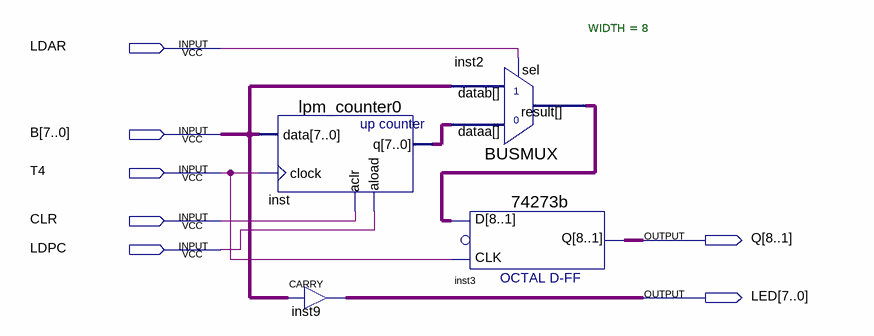
[diagram p0: schematic sheet]
// Quartus schematic Qinka-5.bdf as structural Verilog: 4 symbols, 7 pins
module \Qinka-5  (
  input  LDAR,
  input  [7:0] B,
  input  T4,
  input  CLR,
  input  LDPC,
  output [8:1] Q,
  output [7:0] LED
);

  wire [7:0] inst2_result, inst_q;

  lpm_counter0 inst (.data(B), .clock(T4), .aclr(CLR), .aload(LDPC), .q(inst_q));
  CARRY inst9[7:0] (.IN(B), .OUT(LED));
  BUSMUX #(.WIDTH(8)) inst2 (.datab(B), .sel(LDAR), .dataa(inst_q), .result(inst2_result));
  \74273b  inst3 (.CLK(T4), .D(inst2_result), .Q(Q));
endmodule
